# Altium schematic sheet Battery.SchDoc
size A3; SheetNumber: 5; SheetTotal: 9
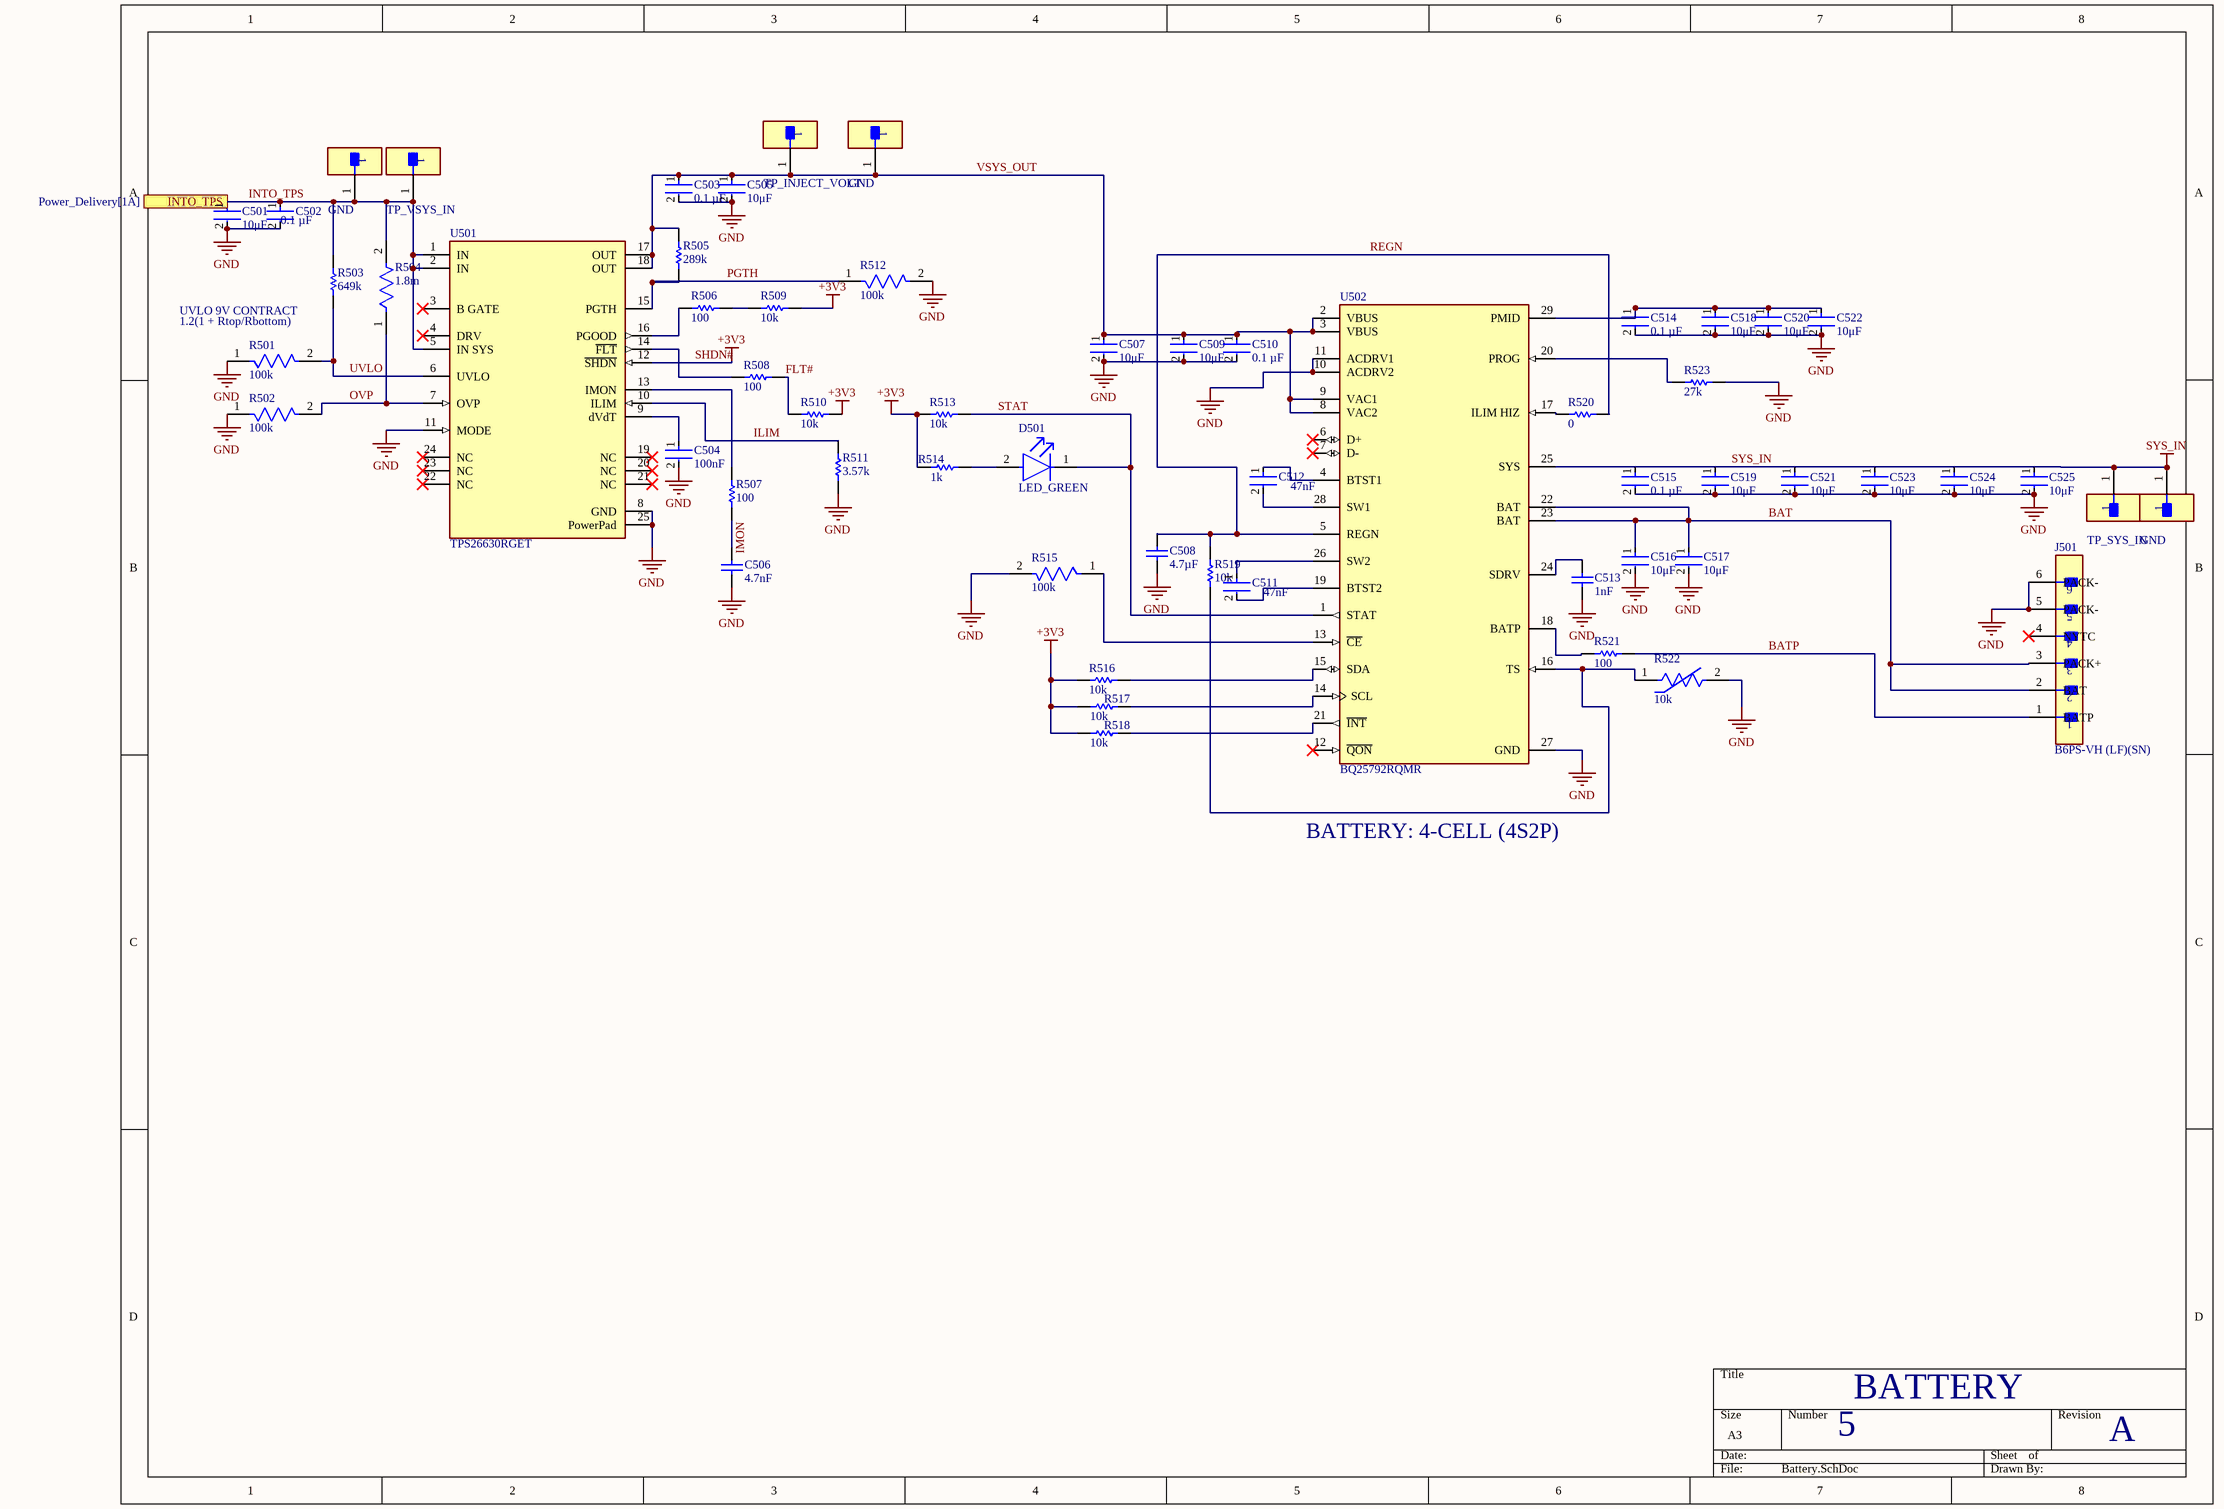
[diagram p0: Battery.SchDoc]

## Parts
C501  10μF  [FP-GRM31C-0_2-e0_3_0_8-MFG]
C502  0.1 µF  [FP-GRM155-0_05-IPC_B]
C503  0.1 µF  [FP-GRM155-0_05-IPC_B]
C504  100nF  [FP-GRM155-0_05-IPC_C]
C505  10μF  [FP-GRM31C-0_2-e0_3_0_8-MFG]
C506  4.7nF  [CAPC1005X55X25LL05T10]
C507  10μF  [FP-GRM31C-0_2-e0_3_0_8-MFG]
C508  4.7µF  [CAPC1608X90X35NL10T15]
C509  10μF  [FP-GRM31C-0_2-e0_3_0_8-MFG]
C510  0.1 µF  [FP-GRM155-0_05-IPC_B]
C511  47nF  [FP-GRM155-0_05-MFG]
C512  47nF  [FP-GRM155-0_05-MFG]
C513  1nF  [CAPC1005X55X25ML5T10]
C514  0.1 µF  [FP-GRM155-0_05-IPC_B]
C515  0.1 µF  [FP-GRM155-0_05-IPC_B]
C516  10μF  [FP-GRM31C-0_2-e0_3_0_8-MFG]
C517  10μF  [FP-GRM31C-0_2-e0_3_0_8-MFG]
C518  10μF  [FP-GRM31C-0_2-e0_3_0_8-MFG]
C519  10μF  [FP-GRM31C-0_2-e0_3_0_8-MFG]
C520  10μF  [FP-GRM31C-0_2-e0_3_0_8-MFG]
C521  10μF  [FP-GRM31C-0_2-e0_3_0_8-MFG]
C522  10μF  [FP-GRM31C-0_2-e0_3_0_8-MFG]
C523  10μF  [FP-GRM31C-0_2-e0_3_0_8-MFG]
C524  10μF  [FP-GRM31C-0_2-e0_3_0_8-MFG]
C525  10μF  [FP-GRM31C-0_2-e0_3_0_8-MFG]
D501  LED_GREEN  [FP-SML-D12-MFG]
J501  B6PS-VH (LF)(SN)  [FP-B6PS-VH_LF_SN-MFG]
R501  100k  [FP-RC0402-0_4-IPC_A]
R502  100k  [FP-RC0402-0_4-IPC_A]
R503  649k  [RESC1005X40X25ML05T10]
R504  1.8m  [FP-CRCW0402-e3-MFG]
R505  289k  [RESC1005X40X25LL05T10]
R506  100  [RESC1005X40X25ML05T10]
R507  100  [RESC1005X40X25ML05T10]
R508  100  [RESC1005X40X25ML05T10]
R509  10k  [RESC1005X40X25LL05T10]
R510  10k  [RESC1005X40X25LL05T10]
R511  3.57k  [RESC1005X40X25ML05T10]
R512  100k  [FP-RC0402-0_4-IPC_A]
R513  10k  [RESC1005X40X25LL05T10]
R514  1k  [RESC3216X60X45ML15T20]
R515  100k  [FP-RC0402-0_4-IPC_A]
R516  10k  [RESC1005X40X25LL05T10]
R517  10k  [RESC1005X40X25LL05T10]
R518  10k  [RESC1005X40X25LL05T10]
R519  10k  [RESC1005X40X25LL05T10]
R520  0  [RESC1005X40X25NL05T10]
R521  100  [RESC1005X40X25ML05T10]
R522  10k  [FP-NCP15-NCU15-0_05-IPC_C]
R523  27k  [RESC1005X40X25LL05T10]
TP500  GND  [FP-S2751-46R-MFG]
TP501  TP_VSYS_IN  [FP-S2751-46R-MFG]
TP502  TP_INJECT_VOLT  [FP-S2751-46R-MFG]
TP503  GND  [FP-S2751-46R-MFG]
TP504  TP_SYS_IN  [FP-S2751-46R-MFG]
TP505  GND  [FP-S2751-46R-MFG]
U501  TPS26630RGET  [FP-RGE0024H-MFG]
U502  BQ25792RQMR  [FP-RQM0029A-MFG]

## Ports
INTO_TPS (see Power_Delivery[1A])

## Nets
GND: C501.2 C502.2 C503.2 C504.2 C505.2 C506.1 C507.2 C508.1 C509.2 C510.2 C513.1 C514.2 C515.2 C516.2 C517.2 C518.2 C519.2 C520.2 C521.2 C522.2 C523.2 C524.2 C525.2 J501.5(PACK-) J501.6(PACK-) R501.1 R502.1 R511.1 R512.2 R515.2 R522.2 R523.2 U501.8(GND) U501.11(MODE) U501.25(PowerPad) U502.10(ACDRV2) U502.11(ACDRV1) U502.27(GND)
SHDN#: R509.2 R510.2 R513.1 R514.2 R516.1 R517.1 R518.1 U501.12(~{SHDN})  [also labelled +3V3]
SYS_IN: TP504.1 TP505.1 U502.25(SYS)
BAT: C516.1 C517.1 J501.2(BAT) J501.3(PACK+) U502.22(BAT) U502.23(BAT)
BATP: J501.1(BATP) R521.2
FLT#: R508.2 R510.1
ILIM: R511.2 U501.10(ILIM)
IMON: C506.2 R507.1
INTO_TPS: C501.1 C502.1 R503.2 R504.2 TP500.1 TP501.1 U501.1(IN) U501.2(IN) U501.5(IN_SYS) ; port INTO_TPS
OVP: R502.2 R504.1 U501.7(OVP)
PGTH: R505.1 R512.1 U501.15(PGTH)
REGN: C508.2 R519.1 R520.2 U502.5(REGN)
STAT: D501.1(C) R513.2 U502.1(STAT)
UVLO: R501.2 R503.1 U501.6(UVLO)
VSYS_OUT: C503.1 C505.1 C507.1 C509.1 C510.1 R505.2 TP502.1 TP503.1 U501.17(OUT) U501.18(OUT) U502.2(VBUS) U502.3(VBUS) U502.8(VAC2) U502.9(VAC1)
NetC504_1: C504.1 U501.9(dVdT)
NetC511_1: C511.1 U502.26(SW2)
NetC511_2: C511.2 U502.19(BTST2)
NetC512_1: C512.1 U502.4(BTST1)
NetC512_2: C512.2 U502.28(SW1)
NetC513_2: C513.2 U502.24(SDRV)
NetC514_1: C514.1 C518.1 C520.1 C522.1 U502.29(PMID)
NetD501_2: D501.2(A) R514.1
NetR506_1: R506.1 U501.16(PGOOD)
NetR506_2: R506.2 R509.1
NetR507_2: R507.2 U501.13(IMON)
NetR508_1: R508.1 U501.14(~{FLT})
NetR515_1: R515.1 U502.13(~{CE})
NetR516_2: R516.2 U502.15(SDA)
NetR517_2: R517.2 U502.14(SCL)
NetR518_2: R518.2 U502.21(~{INT})
NetR519_2: R519.2 R522.1 U502.16(TS)
NetR520_1: R520.1 U502.17(ILIM_HIZ)
NetR521_1: R521.1 U502.18(BATP)
NetR523_1: R523.1 U502.20(PROG)

Not connected (* = marked no-connect by the designer): C515 1; C519 1; C521 1; C523 1; C524 1; C525 1; J501 4(NYTC)*; U501 3(B_GATE)* 4(DRV)* 19(NC)* 20(NC)* 21(NC)* 22(NC)* 23(NC)* 24(NC)*; U502 6(D+)* 7(D-)* 12(~{QON})*

## Notes on the sheet
- UVLO 9V CONTRACT
- 1.2(1 + Rtop/Rbottom)
- BATTERY: 4-CELL (4S2P)
- 5
- BATTERY
- A

## Library data of the parts
C501 C505 C507 C509 C516-C525 = CMP-06035-005515-1: Chip Multilayer Ceramic Capacitors for General Purpose, 1206, 10uF, X7R, 15%, 10%, 25V; Dielectric: X7R; Max Operating Temperature: 125°C; Capacitance: 10uF; Voltage Rating (DC): 25V; Case/Package: 1206; Thickness: 0.071inch; Tolerance: 10%; Voltage Rating: 25V; Mount: Surface Mount; Width: 0.063inch; Length: 0.126inch; Min Operating Temperature: -55°C; Packaging: Tape and Reel; Lead Free: Lead Free; Voltage: 25V
C502 C503 C510 C514 C515 = CMP-06035-003750-1: Chip Multilayer Ceramic Capacitors for General Purpose, 0402, 0.10uF, X7R, 15%, 10%, 50V; Capacitance: 100nF; Weight: 0.000212oz; Package Quantity: 50000; Resistor Type: Ceramic; Mount: Surface Mount; Width: 0.5mm; Case Code (Imperial): 0402; Termination: SMD/SMT; Case/Package: 0402; Voltage Rating: 50V; Height: 0.5mm; Length: 0.039inch; Dielectric: X7R; Case Code (Metric): 1005; Min Operating Temperature: -55°C; Thickness: 0.022inch; Tolerance: 10%; Lead Free: Lead Free; Packaging: Tape and Reel; Max Operating Temperature: 125°C; Voltage Rating (DC): 50V
C504 = CMP-06035-003995-1: Chip Multilayer Ceramic Capacitors for General Purpose, 0402, 0.10uF, X7R, 15%, 10%, 25V; Resistor Type: Ceramic; Capacitance: 100nF; Tolerance: 10%; Case Code (Metric): 1005; Termination: SMD/SMT; Mount: Surface Mount; Voltage Rating: 25V; Voltage Rating (DC): 25V; Case Code (Imperial): 0402; Max Operating Temperature: 125°C; Weight: 0.000212oz; Case/Package: 0402; Length: 0.039inch; Width: 0.5mm; Thickness: 0.022inch; Height: 0.5mm; Packaging: Tape and Reel; Package Quantity: 50000; Min Operating Temperature: -55°C; Dielectric: X7R
C506 = CMP-2008-04609-1: Manufacturer: Murata; Part Number: GRM155R71C472KA01D
C508 = CMP-2006-02810-1: Manufacturer: Murata; Part Number: GRM188R61A475KE15D
C511 C512 = CMP-06035-009452-1: Chip Multilayer Ceramic Capacitors for General Purpose, 0402, 47000pF, X7R, 15%, 10%, 50V; Tolerance: 10%; Capacitance: 47nF; Max Operating Temperature: 125°C; Termination: SMD/SMT; Width: 0.02inch; Package Quantity: 10000; Resistor Type: Ceramic; Packaging: Tape and Reel; Height: 0.5mm; Voltage Rating (DC): 50V; Length: 0.039inch; Dielectric: X7R; Case Code (Imperial): 0402; Voltage Rating: 50V; Mount: Surface Mount; Min Operating Temperature: -55°C; Case Code (Metric): 1005; Weight: 0.000212oz; Case/Package: 0402; Thickness: 0.022inch
C513 = CMP-1662-00017-1: Chip Capacitor, 1 nF, +/- 10%, 50 V, -55 to 125 degC, 0402 (1005 Metric), RoHS, Tape and Reel; Case\/Package: 0402; Type (Capacitors): X7R; Voltage Rating (DC): 50 V; Width: 0.5 mm; Pins: 2; REACH SVHC: No SVHC; Length: 1 mm; Height: 0.5 mm; PackageDescription: 2-Pin Surface Mount Device, Body 1 x 0.5 mm; DatasheetVersion: 07/2016; Mount: Surface Mount; ComponentLink2Description: Datasheet; Tolerance: 10%; ComponentLink2URL: http://psearch.en.murata.com/capacitor/product/GRM155R71H102KA01%23.pdf; ComponentLink1URL: http://www.murata.com/; Case Code (Metric): 1005; Package Quantity: 10000; Min Operating Temperature: -55 degC; Max Operating Temperature: 125 degC; Capacitance: 1 nF; Voltage Rating: 50 V; ComponentLink1Description: Manufacturer URL; Packaging: Tape and Reel; Radiation Hardening: No; RoHSCompliant: true; PackageReference: 0402; Mounting Technology: Surface Mount; Case Code (Imperial): 0402
D501 = CMP-08952-000005-1: LED YLW/GREEN DIFFUSED 1608 SMD; Manufacturer Part Number: SML-D12M1WT86; Manufacturer: Rohm; Led Orientation: Top View; Forward Voltage: 2.2V; Power Dissipation: 54mW; Wavelength: 572nm; Colour: Green; Reverse Voltage: 5V; Forward Current: 20mA; Luminous Intensity: 30mcd; RoHS: TRUE; Package: SML-D12; Temperature Range Low: -40°C; Device Class L3: unset; Temperature Range High: +85°C; Device Class L2: LEDs; Category: Diode; Device Class L1: Optoelectronics; Digikey Description: LED YLW/GREEN DIFFUSED 1608 SMD; Temperature: -40°C to +85°C; ComponentLink2Description: Datasheet; Automotive: No; Height: 0.65mm; Lead Free: Yes; Octopart: https://octopart.com/sml-d12m1wt86-rohm-70837112; ComponentLink2URL: https://www.rohm.com/datasheet/SML-D12M1W
J501 = CMP-17439-000282-2: CONN HEADER R/A 6POS 3.96MM; Gender: Male; Contact Resistance: 20mR; Max Current Rating: 10A; Voltage Rating: 250V; Number of Contacts: 6; Packaging: Bulk; Current Rating: 10A; Contact Mating Length: 0.303inch; Fastening Type: Ramp; Contact Material: Brass; Number of Rows: 1; Termination: Solder; Number of Positions: 6; Depth: 14.9mm; Orientation: Right Angle; Contact Finish - Mating: TIN; Contact Plating: Copper; Mount: Through Hole; Insulation Material: Nylon; Contact Type: Male Pin; Insulation Color: Natural; Max Voltage Rating (AC): 250V; Housing Color: White; Length: 23.7mm; Min Operating Temperature: -25°C; Series: VH; Connector Type: Header; Pitch: 3.96mm; Flammability Rating: UL94 V-0; Max Operating Temperature: 85°C; Color: Natural; Lead Free: Lead Free; Housing Material: Polyamide; Contact Shape: Square
R501 R502 R512 R515 = CMP-2002-07913-2: RES 100K OHM 5% 1/16W 0402; Temperature Coefficient: 100ppm/°C; Max Power Dissipation: 63mW; Resistance: 100kR; Voltage Rating: 50V; Tolerance: 5%; Packaging: Tape and Reel; Termination: SMD/SMT; Case Code (Metric): 1005; Length: 1mm; Power Rating: 63mW; Min Operating Temperature: -55°C; Case/Package: 0402; Construction: Rectangular; Series: RC; Resistance Tolerance: 5%; Height: 0.016inch; Case Code (Imperial): 0402; RoHS Compliant: Yes; Size Code: 0402; Number of Terminations: 2; Features: Moisture Resistant; Width: 0.02inch; Max Operating Temperature: 155°C; Military Standard: Not; Lead Free: Lead Free; Depth: 0.5mm; Package Quantity: 1; Resistor Type: Thick Film
R503 = CMP-2002-07136-1: Part Number: RC0402FR-07649KL; Manufacturer: Yageo / Phycomp
R504 = CMP-2002-08335-4: RES Thick Film, 1.78MΩ, 1%, 0.063W, 100ppm/°C, 0402; Max Power Dissipation: 63mW; Resistance: 1.78MR; Voltage Rating: 50V; Package Quantity: 10000; Depth: 0.5mm; Length: 1mm; Weight: 2.3E-05oz; Width: 0.5mm; Case Code (Imperial): 0402; Radiation Hardening: No; Number of Terminations: 2; Temperature Coefficient: 100ppm/°C; Lead Free: Lead Free; Contact Plating: Tin; Voltage Rating (DC): 50V; Height: 0.016inch; Features: Automotive AEC-Q200; Case Code (Metric): 1005; Max Operating Temperature: 155°C; Case/Package: 0402; Number of Pins: 2; Power Rating: 63mW; Tolerance: 1%; Packaging: Tape and Reel; Military Standard: Not; Composition: Thick Film; Min Operating Temperature: -55°C
R505 = CMP-1011-00786-2: Part Number: RC0402FR-07287KL; Manufacturer: Yageo
R506-R508 R521 = CMP-2002-07344-1: Part Number: RC0402FR-07100RL; Manufacturer: Yageo / Phycomp
R509 R510 R513 R516-R519 = CMP-2002-07353-1: Part Number: RC0402FR-0710KL; Manufacturer: Yageo / Phycomp
R511 = CMP-2002-07655-1: Part Number: RC0402FR-073K57L; Manufacturer: Yageo
R514 = CMP-2100-03616-1: Chip Resistor, 1 KOhm, +/- 1%, 0.25 W, -55 to 155 degC, 1206 (3216 Metric), RoHS, Tape and Reel; Manufacturer: Vishay Semiconductor; Power Rating: 250mW; Voltage Rating (DC): 200V; Resistance: 1KOhm; Temperature Coefficient: 100ppm/degreesC; Case Code (Imperial): 1206; Length: 3.2mm; Case/Package: 1206; Contact Plating: Tin; Package Quantity: 10; Datasheet URL: http://www.farnell.com/datasheets/1720486.pdf; Mount: SurfaceMount; Package Description: 2-Pin Surface Mount Device, Body 3.15 x 1.6 mm; Package Reference: 1206.0; Max Operating Temperature: 155degC; Lead Free: LeadFree; Weight: 0.000353oz; Military Standard: Not; Max Power Dissipation: 250mW; Case Code (Metric): 3216; Number of Terminations: 2; Tolerance: 1%; Width: 0.063inch; Termination: SMD/SMT; Number of Pins: 2; Min Operating Temperature: -55degC; Height: 0.55mm; Depth: 1.6mm; RoHSCompliant: true; Composition: ThickFilm; Packaging: TapeandReel; Manufacturer URL: http://www.vishay.com/; Voltage Rating: 200V; Radiation Hardening: No; REACH SVHC: Unknown; Datasheet Version: 41061.0
R520 = CMP-1011-00001-2: Manufacturer: Yageo / Phycomp; Part Number: RC0402JR-070RL
R522 = CMP-06022-000003-3: NTC Thermistor for Temperature Sensor, 0402, 10kΩ, 1%, 0.1mA, 5V; Max Power Dissipation: 100mW; Resistance: 10kR; Current Rating: 310uA; Length: 1mm; Min Operating Temperature: -40°C; Max Operating Temperature: 125°C; Resistance Tolerance: 1%; Lead Free: Lead Free; Radiation Hardening: No; Case Code (Imperial): 0402; Depth: 0.5mm; Tolerance: 1%; Packaging: Tape and Reel; Package Quantity: 10000; Series: NCP; Number of Pins: 2; Power Rating: 100mW; Case/Package: 0402; Case Code (Metric): 1005; Height: 0.5mm; Termination: SMD/SMT; RoHS Compliant: Yes; REACH SVHC: No SVHC; Mount: Surface Mount
R523 = CMP-2002-07025-1: Manufacturer: Yageo / Phycomp; Part Number: RC0402FR-0727KL
TP500-TP505 = CMP-15817-000010-1: PC TEST POINT NATURAL; Plating: Tin; Body Material: Brass; Color: Natural; Material: Copper Alloy; Mount: Surface Mount; Packaging: Cut Tape
U501 = CMP-04910-000050-1: POWER MANAGEMENT; RoHS Compliant: Yes
U502 = CMP-04911-000031-1: I2C CONTROLLED, 5-A, 1-4 CELL BU; RoHS Compliant: Yes